# Altium schematic sheet Sheet_1_2022-06-08.schdoc
size 224 x 95 mm
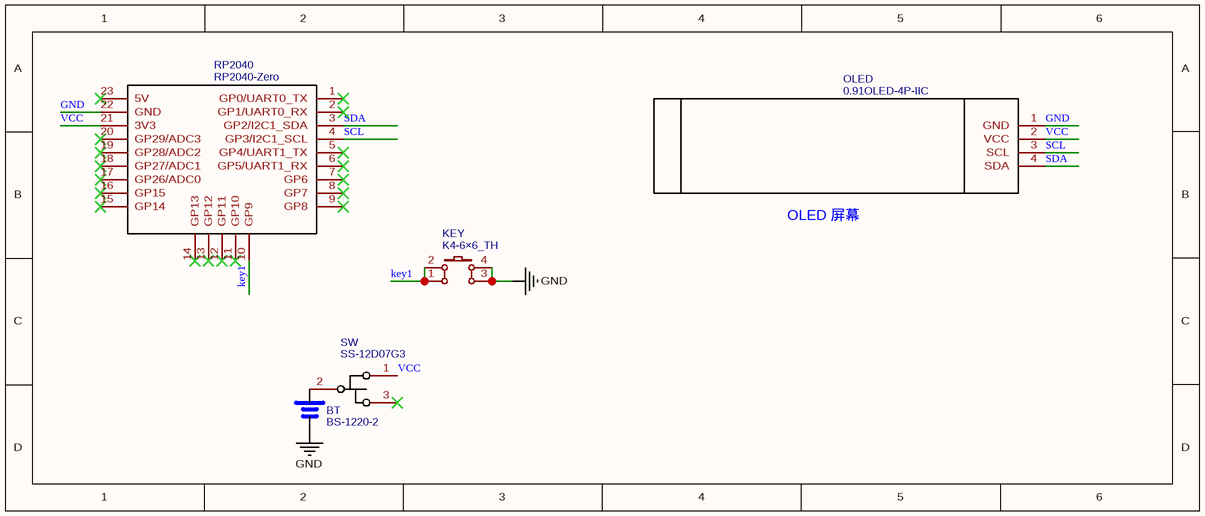
[diagram p0: Sheet_1_2022-06-08.schdoc]

## Parts
BT  BS-1220-2  [BS-1220-2]
KEY  K4-6×6_TH  [KEY-TH_4P-L6.0-W6.0-P4.50-LS6.5]
OLED  0.91OLED-4P-IIC  [OLED-0.91-2.54*4P-IIC]
RP2040  RP2040-Zero  [RP2040-ZERO]
SW  SS-12D07G3  [J-SS 12D07]

## Nets
GND: BT.2 KEY.3 KEY.4 OLED.1(GND) RP2040.22(GND)
key1: KEY.1 KEY.2 RP2040.10(GP9)
SCL: OLED.3(SCL) RP2040.4(GP3/I2C1_SCL)
SDA: OLED.4(SDA) RP2040.3(GP2/I2C1_SDA)
VCC: OLED.2(VCC) RP2040.21(3V3) SW.1
NetBT_1: BT.1 SW.2

Not connected (* = marked no-connect by the designer): RP2040 1(GP0/UART0_TX)* 2(GP1/UART0_RX)* 5(GP4/UART1_TX)* 6(GP5/UART1_RX)* 7(GP6)* 8(GP7)* 9(GP8)* 11(GP10)* 12(GP11)* 13(GP12)* 14(GP13)* 15(GP14)* 16(GP15)* 17(GP26/ADC0)* 18(GP27/ADC1)* 19(GP28/ADC2)* 20(GP29/ADC3)* 23(5V)*; SW 3*

## Notes on the sheet
- (in symbol 0.91OLED-4P-IIC) OLED 屏幕

## Library data of the parts
BT = BS-1220-2: Contributor: 18868726200; spicePre: B; spiceSymbolName: BS-1220-2
KEY = K4-6×6_TH: BOM_Manufacturer: 韩国韩荣; BOM_Manufacturer Part: K2-1102DP-E4SW-04; Contributor: LCEDA_Lib; BOM_Supplier: LCSC; BOM_Supplier Part: C136684; spicePre: K; spiceSymbolName: K4-6×6_TH
OLED = 0.91OLED-4P-IIC: Contributor: lemondx; spicePre: U; spiceSymbolName: 0.91OLED-4P-IIC
RP2040 = RP2040-Zero: Contributor: MoyunHui; spicePre: U; spiceSymbolName: RP2040-Zero
SW = SS-12D07G3: Contributor: 技小新团队; BOM_Supplier Part: C64633; BOM_Supplier: LCSC; spicePre: S; spiceSymbolName: SS-12D07G3